# Altium project radxa_cm3_io_board_v1360_schematic.PrjPcb (part 3 of 5)

## Sheet 12.USB OTG_ HUB.SchDoc: CM3 IO
size 420 x 297 mm; Page Create Date: March  8, 1995; Page Number: 12; Page Size: A3; Comment: radxa_1010; Page Count: 20; RevCode: 1.36; Doc: USB OTG/ HUB; DsnPath: D:\WMS\黄工\[RC119]CM3_IO_V1.36\对外资料\radxa_cm3_io_board_v1360.DSN; SchematicName: CM3_IO V1.36; PageName: 12.USB OTG/ HUB; PageSize: A3; TopSchematic: True
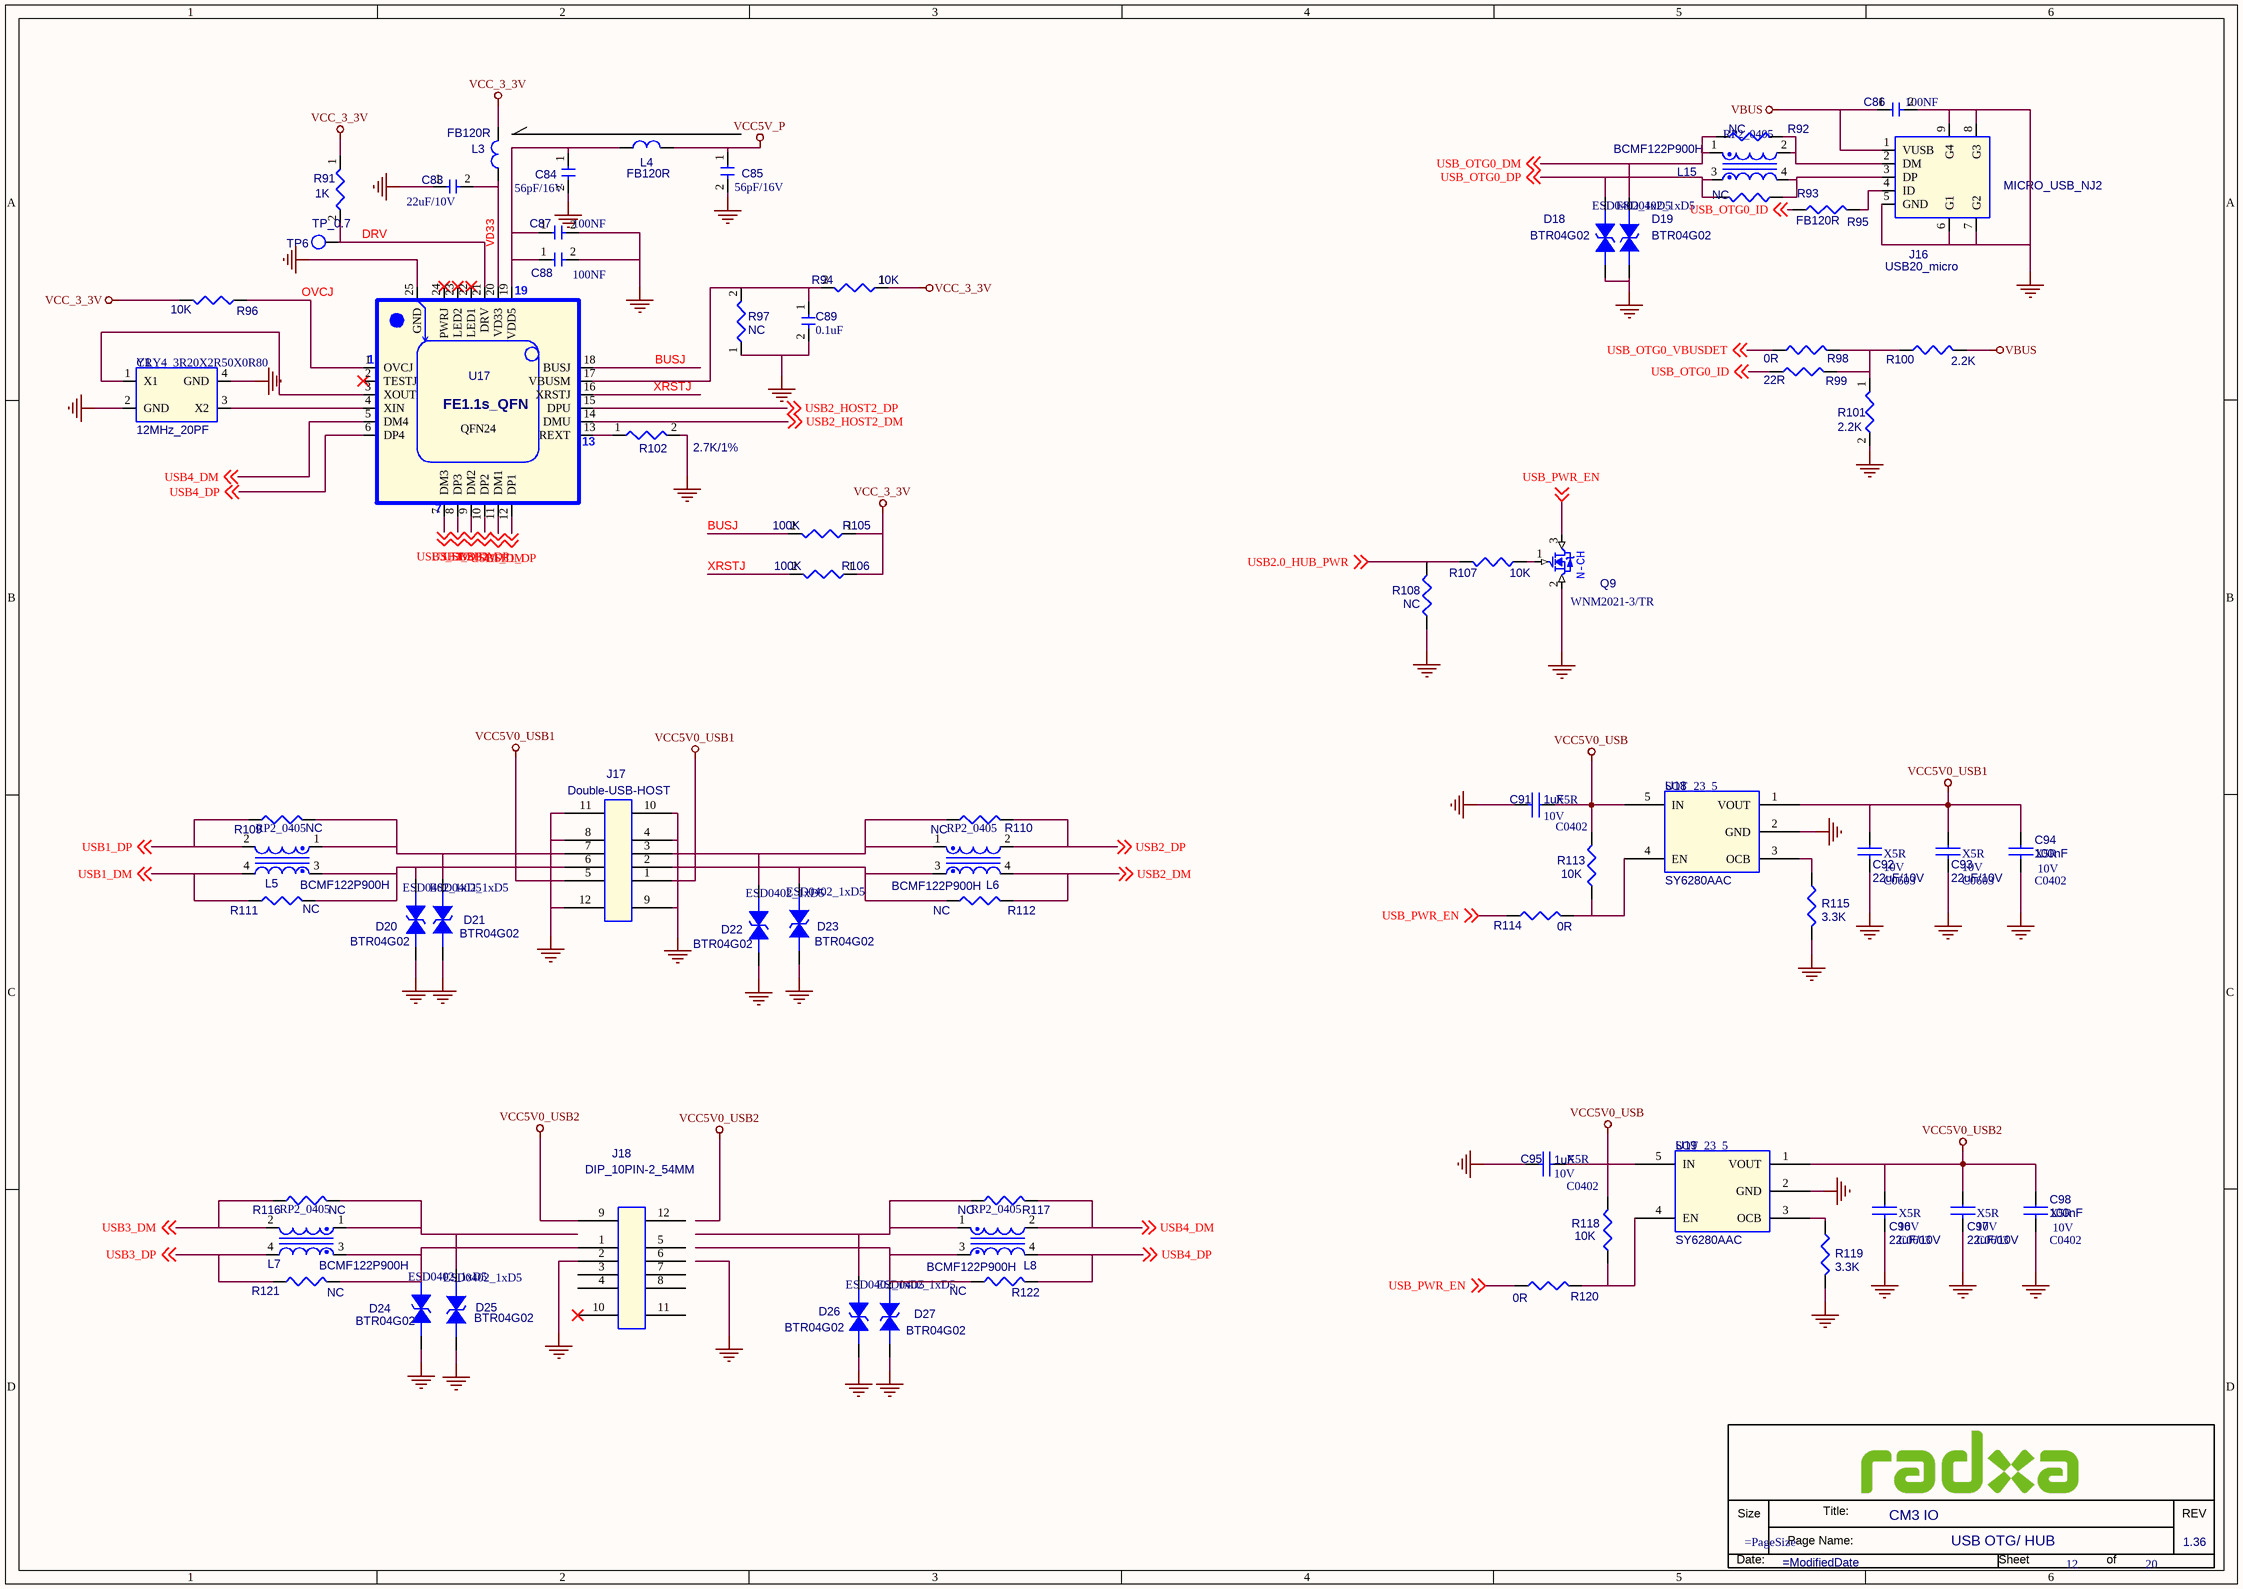
[diagram p10: 12.USB OTG_ HUB.SchDoc]

### Parts
(Parts that share a designator on the sheet are numbered #1, #2 ... from top to bottom, then left to right.)
*#11  Doc: USB OTG/ HUB  RevCode: 1.36  Title: CM3 IO  Page Number: 12  Page Count: 20  (hidden comment: radxa_1010)  (graphical)
C83  22uF/10V  [C0603]
C84  56pF/16V  [C0603]
C85  56pF/16V  [C0603]
C86  100NF  [C0603]
C87  100NF  [C0603]
C88  100NF  [C0603]
C89  0.1uF  [C0603]
C91  1uF  Voltage: 10V  Dielectric: X5R  [C0402]
C92  22uF/10V  Voltage: 10V  Dielectric: X5R  [C0603]
C93  22uF/10V  Voltage: 10V  Dielectric: X5R  [C0603]
C94  100nF  Voltage: 10V  Dielectric: X5R  [C0402]
C95  1uF  Voltage: 10V  Dielectric: X5R  [C0402]
C96  22uF/10V  Voltage: 10V  Dielectric: X5R  [C0603]
C97  22uF/10V  Voltage: 10V  Dielectric: X5R  [C0603]
C98  100nF  Voltage: 10V  Dielectric: X5R  [C0402]
D18  BTR04G02  [ESD0402_1xD5]
D19  BTR04G02  [ESD0402_1xD5]
D20  BTR04G02  [ESD0402_1xD5]
D21  BTR04G02  [ESD0402_1xD5]
D22  BTR04G02  [ESD0402_1xD5]
D23  BTR04G02  [ESD0402_1xD5]
D24  BTR04G02  [ESD0402_1xD5]
D25  BTR04G02  [ESD0402_1xD5]
D26  BTR04G02  [ESD0402_1xD5]
D27  BTR04G02  [ESD0402_1xD5]
J16  USB20_micro  PCB Footprint: MICRO_USB_NJ2  [USB-5PAA]
J17  Double-USB-HOST  [USB_DUAL]
J18  DIP_10PIN-2_54MM  [DIP_10PIN-2_54MM]
L3  FB120R  [R0402]
L4  FB120R  [L0402]
L5  BCMF122P900H  PCB Footprint: RP2_0405  [L0402D]
L6  BCMF122P900H  PCB Footprint: RP2_0405  [L0402D]
L7  BCMF122P900H  PCB Footprint: RP2_0405  [L0402D]
L8  BCMF122P900H  PCB Footprint: RP2_0405  [L0402D]
L15  BCMF122P900H  PCB Footprint: RP2_0405  [L0402D]
Q9  WNM2021-3/TR  [S0T-23]
R91  1K  [R0603]
R92  NC  [R0201]
R93  NC  [R0201]
R94  10K  [R0603]
R95  FB120R  [R0402]
R96  10K  [R0402]
R97  NC  [R0603]
R98  0R  [R0402]
R99  22R  [R0402]
R100  2.2K  [R0402]
R101  2.2K  [R0603]
R102  2.7K/1%  [R0603]
R105  100K  [R0603]
R106  100K  [R0603]
R107  10K  [R0402]
R108  NC  [R0402]
R109  NC  [R0201]
R110  NC  [R0201]
R111  NC  [R0201]
R112  NC  [R0201]
R113  10K  [R0402]
R114  0R  [R0402]
R115  3.3K  [R0402]
R116  NC  [R0201]
R117  NC  [R0201]
R118  10K  [R0402]
R119  3.3K  [R0402]
R120  0R  [R0402]
R121  NC  [R0201]
R122  NC  [R0201]
TP6  TP_0.7  [TEST]
U17  FE1.1s_QFN  [QFN24]
U18  SY6280AAC  [SOT_23_5]
U19  SY6280AAC  [SOT_23_5]
Y1  12MHz_20PF  PCB Footprint: CRY4_3R20X2R50X0R80  [CRY-3225]

### Nets
GND: C83.1 C84.2 C85.2 C86.2 C87.2 C88.2 C89.2 C91.2 C92.2 C93.2 C94.2 C95.2 C96.2 C97.2 C98.2 D18.1 D19.1 D20.1 D21.1 D22.1 D23.1 D24.1 D25.1 D26.1 D27.1 J16.5(GND) J16.6(G1) J16.7(G2) J16.8(G3) J16.9(G4) J17.4 J17.8 J17.9 J17.10 J17.11 J17.12 J18.2 Q9.2(S) R97.1 R101.2 R102.2 R108.2 R115.2 R119.2 U17.25(GND) U18.2(GND) U19.2(GND) Y1.2(GND) Y1.4(GND)
VBUS: C86.1 J16.1(VUSB) R100.2
VCC5V0_USB: C91.1 C95.1 R113.1 R118.1 U18.5(IN) U19.5(IN)
VCC5V0_USB1: C92.1 C93.1 C94.1 J17.1 J17.5 U18.1(VOUT)
VCC5V0_USB2: C96.1 C97.1 C98.1 J18.9 U19.1(VOUT)
VCC5V_P: C85.1 L4.1
VCC_3_3V: L3.2 R91.1 R94.1 R96.1 R105.1 R106.1
BUSJ: R105.2 U17.18(BUSJ)
DRV: R91.2 TP6.1 U17.21(DRV)
OVCJ: R96.2 U17.1(OVCJ)
USB1_DM: L5.4 R111.1 U17.11(DM1) ; off-sheet USB1_DM
USB1_DP: L5.2 R109.1 U17.12(DP1) ; off-sheet USB1_DP
USB2.0_HUB_PWR: R107.2 R108.1 ; off-sheet USB2.0_HUB_PWR
USB2_DM: L6.4 R112.1 U17.9(DM2) ; off-sheet USB2_DM
USB2_DP: L6.2 R110.1 U17.10(DP2) ; off-sheet USB2_DP
USB2_HOST2_DM: U17.14(DMU) ; off-sheet USB2_HOST2_DM
USB2_HOST2_DP: U17.15(DPU) ; off-sheet USB2_HOST2_DP
USB3_DM: L7.2 R116.1 U17.7(DM3) ; off-sheet USB3_DM
USB3_DP: L7.4 R121.1 U17.8(DP3) ; off-sheet USB3_DP
USB4_DM: L8.2 R117.1 U17.5(DM4) ; off-sheet USB4_DM
USB4_DP: L8.4 R122.1 U17.6(DP4) ; off-sheet USB4_DP
USB_OTG0_DM: D19.2 L15.1 R92.2 ; off-sheet USB_OTG0_DM
USB_OTG0_DP: D18.2 L15.3 R93.2 ; off-sheet USB_OTG0_DP
USB_OTG0_ID: R95.2 R99.2 ; off-sheet USB_OTG0_ID
USB_OTG0_VBUSDET: R98.2 ; off-sheet USB_OTG0_VBUSDET
USB_PWR_EN: Q9.3(D) R114.2 R120.2 ; off-sheet USB_PWR_EN
VD33: C83.2 L3.1 U17.20(VD33)
XRSTJ: R106.2 U17.16(XRSTJ)
NetC84_1: C84.1 C87.1 C88.1 L4.2 U17.19(VDD5)
NetC89_1: C89.1 R94.2 R97.2 U17.17(VBUSM)
NetD20_2: D20.2 J17.6 L5.3 R111.2
NetD21_2: D21.2 J17.7 L5.1 R109.2
NetD22_2: D22.2 J17.3 L6.1 R110.2
NetD23_2: D23.2 J17.2 L6.3 R112.2
NetD24_2: D24.2 J18.1 L7.3 R121.2
NetD25_2: D25.2 L7.1 R116.2
NetD26_2: D26.2 L8.1 R117.2
NetD27_2: D27.2 L8.3 R122.2
NetJ16_2: J16.2(DM) L15.2 R92.1
NetJ16_3: J16.3(DP) L15.4 R93.1
NetJ16_4: J16.4(ID) R95.1
NetQ9_1: Q9.1(G) R107.1
NetR98_1: R98.1 R99.1 R100.1 R101.1
NetR102_1: R102.1 U17.13(REXT)
NetR113_2: R113.2 R114.1 U18.4(EN)
NetR115_1: R115.1 U18.3(OCB)
NetR118_2: R118.2 R120.1 U19.4(EN)
NetR119_1: R119.1 U19.3(OCB)
NetU17_3: U17.3(XOUT) Y1.1(X1)
NetU17_4: U17.4(XIN) Y1.3(X2)

Not connected (* = marked no-connect by the designer): J18 3 4 5 6 7 8 10* 11 12; U17 2(TESTJ)* 22(LED1)* 23(LED2)* 24(PWRJ)*

### Notes on the sheet
- (in symbol N-MOSFET) N-CH
- (in symbol radxa_1010) Title:; Size; REV; Page Name:; Date:; Sheet; of

### Library data of the parts
C83 = CAP_0.1uF_0603: Part Reference: C83; Value: 22uF/10V; PCB Footprint: C0603
C84 = CAP_0.1uF_0603: Part Reference: C84; PCB Footprint: C0402; Value: 56pF/16V
C85 = CAP_0.1uF_0603: Part Reference: C85; PCB Footprint: C0402; Value: 56pF/16V
C86 = CAP_0.1uF_0603: Part Reference: C86; PCB Footprint: C0402; Value: 100NF
C87 = CAP_0.1uF_0603: Part Reference: C87; PCB Footprint: C0402; Value: 100NF
C88 = CAP_0.1uF_0603: Part Reference: C88; PCB Footprint: C0402; Value: 100NF
C89 = CAP_0.1uF_0603: Part Reference: C89; PCB Footprint: C0402; Value: 0.1uF
C91 = CAP NP_0: cap,1.00uF,+/-10%,10V,X5R,C0402; Part Reference: C91; Manufacturer: TDK; RK PN: C1005X5R1A105K050BB; Priority: A; C_Voltage: 6.3V; Tolerance: 10%; PCB Footprint: C0402; Value: 1uF; Part Type: C0402; Manufacturer PN: C1005X5R1A105K050BB; Created by: JJJ
C92 = CAP NP_0: cap,100.00nF,+/-10%,10V,X5R,C0402; Part Reference: C92; Manufacturer PN: C1005X5R1A104K050BA; Manufacturer: TDK; Tolerance: 10%; Priority: A; PCB Footprint: C0603; Value: 22uF/10V; Created by: JJJ; Part Type: C0402; RK PN: C1005X5R1A104K050BA
C93 = CAP NP_0: cap,100.00nF,+/-10%,10V,X5R,C0402; Part Reference: C93; Manufacturer PN: C1005X5R1A104K050BA; Manufacturer: TDK; Tolerance: 10%; Priority: A; PCB Footprint: C0603; Value: 22uF/10V; Created by: JJJ; Part Type: C0402; RK PN: C1005X5R1A104K050BA
C94 = CAP NP_0: cap,100.00nF,+/-10%,10V,X5R,C0402; Part Reference: C94; Manufacturer: TDK; RK PN: C1005X5R1A104K050BA; Priority: A; Tolerance: 10%; PCB Footprint: C0402; Value: 100nF; Part Type: C0402; Manufacturer PN: C1005X5R1A104K050BA; Created by: JJJ
C95 = CAP NP_0: cap,1.00uF,+/-10%,10V,X5R,C0402; Part Reference: C95; Manufacturer PN: C1005X5R1A105K050BB; Manufacturer: TDK; Tolerance: 10%; C_Voltage: 6.3V; Priority: A; PCB Footprint: C0402; Value: 1uF; Created by: JJJ; Part Type: C0402; RK PN: C1005X5R1A105K050BB
C96 = CAP NP_0: cap,100.00nF,+/-10%,10V,X5R,C0402; Part Reference: C96; Manufacturer: TDK; RK PN: C1005X5R1A104K050BA; Priority: A; Tolerance: 10%; PCB Footprint: C0603; Value: 22uF/10V; Part Type: C0402; Manufacturer PN: C1005X5R1A104K050BA; Created by: JJJ
C97 = CAP NP_0: cap,100.00nF,+/-10%,10V,X5R,C0402; Part Reference: C97; Manufacturer PN: C1005X5R1A104K050BA; Manufacturer: TDK; Tolerance: 10%; Priority: A; PCB Footprint: C0603; Value: 22uF/10V; Created by: JJJ; Part Type: C0402; RK PN: C1005X5R1A104K050BA
C98 = CAP NP_0: cap,100.00nF,+/-10%,10V,X5R,C0402; Part Reference: C98; Manufacturer: TDK; RK PN: C1005X5R1A104K050BA; Priority: A; Tolerance: 10%; PCB Footprint: C0402; Value: 100nF; Part Type: C0402; Manufacturer PN: C1005X5R1A104K050BA; Created by: JJJ
D18 = DIODE BI_DIR TRIG_0: 1-Line, Bi-directional, Transient Voltage Suppressors.17.5pF.; Part Reference: D18; Manufacturer: WillSemi(韦尔半导体); RK PN: ESD5451N; Priority: A; OPTION: DNP; PCB Footprint: ESD0402_1xD5; Value: BTR04G02; Part Type: ESD_TVS; Manufacturer PN: ESD5451N; Created by: JJJ
D19 = DIODE BI_DIR TRIG_0: 1-Line, Bi-directional, Transient Voltage Suppressors.17.5pF.; Part Reference: D19; Manufacturer PN: ESD5451N; Manufacturer: WillSemi(韦尔半导体); OPTION: DNP; Priority: A; PCB Footprint: ESD0402_1xD5; Value: BTR04G02; Created by: JJJ; Part Type: ESD_TVS; RK PN: ESD5451N
D20 = DIODE BI_DIR TRIG_0: 1-Line, Bi-directional, Transient Voltage Suppressors.17.5pF.; Part Reference: D20; Manufacturer PN: ESD5451N; Manufacturer: WillSemi(韦尔半导体); OPTION: DNP; Priority: A; PCB Footprint: ESD0402_1xD5; Value: BTR04G02; Created by: JJJ; Part Type: ESD_TVS; RK PN: ESD5451N
D21 = DIODE BI_DIR TRIG_0: 1-Line, Bi-directional, Transient Voltage Suppressors.17.5pF.; Part Reference: D21; Manufacturer PN: ESD5451N; Manufacturer: WillSemi(韦尔半导体); OPTION: DNP; Priority: A; PCB Footprint: ESD0402_1xD5; Value: BTR04G02; Created by: JJJ; Part Type: ESD_TVS; RK PN: ESD5451N
D22 = DIODE BI_DIR TRIG_0: 1-Line, Bi-directional, Transient Voltage Suppressors.17.5pF.; Part Reference: D22; Manufacturer PN: ESD5451N; Manufacturer: WillSemi(韦尔半导体); OPTION: DNP; Priority: A; PCB Footprint: ESD0402_1xD5; Value: BTR04G02; Created by: JJJ; Part Type: ESD_TVS; RK PN: ESD5451N
D23 = DIODE BI_DIR TRIG_0: 1-Line, Bi-directional, Transient Voltage Suppressors.17.5pF.; Part Reference: D23; Manufacturer PN: ESD5451N; Manufacturer: WillSemi(韦尔半导体); OPTION: DNP; Priority: A; PCB Footprint: ESD0402_1xD5; Value: BTR04G02; Created by: JJJ; Part Type: ESD_TVS; RK PN: ESD5451N
D24 = DIODE BI_DIR TRIG_0: 1-Line, Bi-directional, Transient Voltage Suppressors.17.5pF.; Part Reference: D24; Manufacturer PN: ESD5451N; Manufacturer: WillSemi(韦尔半导体); OPTION: DNP; Priority: A; PCB Footprint: ESD0402_1xD5; Value: BTR04G02; Created by: JJJ; Part Type: ESD_TVS; RK PN: ESD5451N
D25 = DIODE BI_DIR TRIG_0: 1-Line, Bi-directional, Transient Voltage Suppressors.17.5pF.; Part Reference: D25; Manufacturer PN: ESD5451N; Manufacturer: WillSemi(韦尔半导体); OPTION: DNP; Priority: A; PCB Footprint: ESD0402_1xD5; Value: BTR04G02; Created by: JJJ; Part Type: ESD_TVS; RK PN: ESD5451N
D26 = DIODE BI_DIR TRIG_0: 1-Line, Bi-directional, Transient Voltage Suppressors.17.5pF.; Part Reference: D26; Manufacturer: WillSemi(韦尔半导体); RK PN: ESD5451N; Priority: A; OPTION: DNP; PCB Footprint: ESD0402_1xD5; Value: BTR04G02; Part Type: ESD_TVS; Manufacturer PN: ESD5451N; Created by: JJJ
D27 = DIODE BI_DIR TRIG_0: 1-Line, Bi-directional, Transient Voltage Suppressors.17.5pF.; Part Reference: D27; Manufacturer PN: ESD5451N; Manufacturer: WillSemi(韦尔半导体); OPTION: DNP; Priority: A; PCB Footprint: ESD0402_1xD5; Value: BTR04G02; Created by: JJJ; Part Type: ESD_TVS; RK PN: ESD5451N
J16 = USB20_MICRO: micro型USB2.0座，卧式，贴焊; Part Reference: J16; Manufacturer: 祺华电子; Priority: A; Value: USB20_micro; Created by: JJJ; Manufacturer Part Number: USB20_micro; Part Type: USB Jack; RK PN: USB20_micro
J17 = CON4_0: Part Reference: J17; Value: Double-USB-HOST; PCB Footprint: USB_DUAL
J18 = CON4_0: Part Reference: J18; Value: DIP_10PIN-2_54MM; PCB Footprint: DIP_10PIN-2_54MM
L3 = CHOKE RF: Part Reference: L3; Value: FB120R; PCB Footprint: R0402
L4 = CHOKE RF: Part Reference: L4; Value: FB120R; PCB Footprint: L0402
L5 = INDUCTOR COM: Winding Type Common Mode Choke Coil; Part Reference: L5; Manufacturer PN: SDCW2012-2-900TF; Manufacturer: sunlord; Resonace frequency: 90R@100M; Irms: 330mA; Tolerance: 25%; DC Resistor: 0.35ohm; Priority: A; Value: BCMF122P900H; Created by: JJJ; Part Type: IND; RK PN: SDCW2012-2-900TF
L6 = INDUCTOR COM: Winding Type Common Mode Choke Coil; Part Reference: L6; Manufacturer PN: SDCW2012-2-900TF; Manufacturer: sunlord; Resonace frequency: 90R@100M; Irms: 330mA; Tolerance: 25%; DC Resistor: 0.35ohm; Priority: A; Value: BCMF122P900H; Created by: JJJ; Part Type: IND; RK PN: SDCW2012-2-900TF
L7 = INDUCTOR COM: Winding Type Common Mode Choke Coil; Part Reference: L7; Manufacturer PN: SDCW2012-2-900TF; Manufacturer: sunlord; Resonace frequency: 90R@100M; Irms: 330mA; Tolerance: 25%; DC Resistor: 0.35ohm; Priority: A; Value: BCMF122P900H; Created by: JJJ; Part Type: IND; RK PN: SDCW2012-2-900TF
L8 = INDUCTOR COM: Winding Type Common Mode Choke Coil; Part Reference: L8; Manufacturer: sunlord; RK PN: SDCW2012-2-900TF; Priority: A; DC Resistor: 0.35ohm; Tolerance: 25%; Irms: 330mA; Resonace frequency: 90R@100M; Value: BCMF122P900H; Part Type: IND; Manufacturer PN: SDCW2012-2-900TF; Created by: JJJ
L15 = INDUCTOR COM: Winding Type Common Mode Choke Coil; Part Reference: L15; Manufacturer PN: SDCW2012-2-900TF; Manufacturer: sunlord; Resonace frequency: 90R@100M; Irms: 330mA; Tolerance: 25%; DC Resistor: 0.35ohm; Priority: A; Value: BCMF122P900H; Created by: JJJ; Part Type: IND; RK PN: SDCW2012-2-900TF
Q9 = N-MOSFET: Part Reference: Q9; SANZ_P/N: SK2300; Value: WNM2021-3/TR; Part Type: MOS管; PCB Footprint: S0T-23
R91 = RES_0603: Part Reference: R91; PCB Footprint: R0402; Value: 1K
R92 = RESISTOR_0: 通用厚膜电阻,0R,+/-5%,R0402,1/16W.; Part Reference: R92; Manufacturer: YAGEO; RK PN: RC0402JR-070RL; Priority: A; Tolerance: 5%; Wattage: 1/16W; Value: NC; Part Type: 通用厚膜电阻; Manufacturer PN: RC0402JR-070RL; Created by: YTL; PCB Footprint: R0201
R93 = RESISTOR_0: 通用厚膜电阻,0R,+/-5%,R0402,1/16W.; Part Reference: R93; Manufacturer PN: RC0402JR-070RL; Manufacturer: YAGEO; Wattage: 1/16W; Tolerance: 5%; Priority: A; Value: NC; Created by: YTL; Part Type: 通用厚膜电阻; RK PN: RC0402JR-070RL; PCB Footprint: R0201
R94 = RES_0603: Part Reference: R94; PCB Footprint: R0402; Value: 10K
R95 = RESISTOR_0: 通用厚膜电阻,0R,+/-5%,R0402,1/16W.; Part Reference: R95; Manufacturer: YAGEO; RK PN: RC0402JR-070RL; Priority: A; Tolerance: 5%; Wattage: 1/16W; Value: FB120R; Part Type: 通用厚膜电阻; Manufacturer PN: RC0402JR-070RL; Created by: YTL; PCB Footprint: R0402
R96 = RESISTOR_0: 通用厚膜电阻,0R,+/-5%,R0402,1/16W.; Part Reference: R96; Manufacturer: YAGEO; RK PN: RC0402JR-070RL; Priority: A; Tolerance: 5%; Wattage: 1/16W; option: DNP; Value: 10K; Part Type: 通用厚膜电阻; Manufacturer PN: RC0402JR-070RL; Created by: YTL; PCB Footprint: R0402
R97 = RES_0603: Part Reference: R97; PCB Footprint: R0402; Value: NC
R98 = RESISTOR_0: 通用厚膜电阻,0R,+/-5%,R0402,1/16W.; Part Reference: R98; Manufacturer: YAGEO; RK PN: RC0402JR-070RL; Priority: A; Tolerance: 5%; Wattage: 1/16W; Value: 0R; Part Type: 通用厚膜电阻; Manufacturer PN: RC0402JR-070RL; Created by: YTL; PCB Footprint: R0402
R99 = RESISTOR_0: 通用厚膜电阻,0R,+/-5%,R0402,1/16W.; Part Reference: R99; Manufacturer PN: RC0402JR-070RL; Manufacturer: YAGEO; Wattage: 1/16W; Tolerance: 5%; Priority: A; Value: 22R; Created by: YTL; Part Type: 通用厚膜电阻; RK PN: RC0402JR-070RL; PCB Footprint: R0402
R100 = RESISTOR_0: 通用厚膜电阻,0R,+/-5%,R0402,1/16W.; Part Reference: R100; Manufacturer: YAGEO; RK PN: RC0402JR-070RL; Priority: A; Tolerance: 5%; Wattage: 1/16W; Value: 2.2K; Part Type: 通用厚膜电阻; Manufacturer PN: RC0402JR-070RL; Created by: YTL; PCB Footprint: R0402
R101 = RES_0603: Part Reference: R101; PCB Footprint: R0402; Value: 2.2K
R102 = RES_0603: Part Reference: R102; PCB Footprint: R0402; Value: 2.7K/1%
R105 = RES_0603: Part Reference: R105; PCB Footprint: R0402; Value: 100K
R106 = RES_0603: Part Reference: R106; PCB Footprint: R0402; Value: 100K
R107 = RESISTOR_1: RES,thick film,47KOhm,+/-5%,1/16W,SMD0402; Part Reference: R107; Value: 10K; PCB Footprint: R0402
R108 = RESISTOR_0: RES,thick film,47KOhm,+/-5%,1/16W,SMD0402; Part Reference: R108; MARK: 51K; Value: NC; PCB Footprint: R0402
R109 = RESISTOR_0: 通用厚膜电阻,0R,+/-5%,R0402,1/16W.; Part Reference: R109; Manufacturer: YAGEO; RK PN: RC0402JR-070RL; Priority: A; Tolerance: 5%; Wattage: 1/16W; Value: NC; Part Type: 通用厚膜电阻; Manufacturer PN: RC0402JR-070RL; Created by: YTL; PCB Footprint: R0201
R110 = RESISTOR_0: 通用厚膜电阻,0R,+/-5%,R0402,1/16W.; Part Reference: R110; Manufacturer PN: RC0402JR-070RL; Manufacturer: YAGEO; Wattage: 1/16W; Tolerance: 5%; Priority: A; Value: NC; Created by: YTL; Part Type: 通用厚膜电阻; RK PN: RC0402JR-070RL; PCB Footprint: R0201
R111 = RESISTOR_0: 通用厚膜电阻,0R,+/-5%,R0402,1/16W.; Part Reference: R111; Manufacturer: YAGEO; RK PN: RC0402JR-070RL; Priority: A; Tolerance: 5%; Wattage: 1/16W; Value: NC; Part Type: 通用厚膜电阻; Manufacturer PN: RC0402JR-070RL; Created by: YTL; PCB Footprint: R0201
R112 = RESISTOR_0: 通用厚膜电阻,0R,+/-5%,R0402,1/16W.; Part Reference: R112; Manufacturer PN: RC0402JR-070RL; Manufacturer: YAGEO; Wattage: 1/16W; Tolerance: 5%; Priority: A; Value: NC; Created by: YTL; Part Type: 通用厚膜电阻; RK PN: RC0402JR-070RL; PCB Footprint: R0201
R113 = RESISTOR_0: 通用厚膜电阻,4K7,+/-5%,R0402,1/16W.; Part Reference: R113; Manufacturer PN: RC0402JR-074K7L; Manufacturer: YAGEO; Wattage: 1/16W; Tolerance: 5%; Priority: A; Value: 10K; Created by: YTL; Part Type: 通用厚膜电阻; RK PN: RC0402JR-074K7L; PCB Footprint: R0402
R114 = RESISTOR_0: 通用厚膜电阻,0R,+/-5%,R0402,1/16W.; Part Reference: R114; Manufacturer PN: RC0402JR-070RL; Manufacturer: YAGEO; Wattage: 1/16W; Tolerance: 5%; Priority: A; Value: 0R; Created by: YTL; Part Type: 通用厚膜电阻; RK PN: RC0402JR-070RL; PCB Footprint: R0402
R115 = RESISTOR_0: 通用厚膜电阻,4K7,+/-5%,R0402,1/16W.; Part Reference: R115; Manufacturer PN: RC0402JR-074K7L; Manufacturer: YAGEO; Wattage: 1/16W; Tolerance: 5%; Priority: A; Value: 3.3K; Created by: YTL; Part Type: 通用厚膜电阻; RK PN: RC0402JR-074K7L; PCB Footprint: R0402
R116 = RESISTOR_0: 通用厚膜电阻,0R,+/-5%,R0402,1/16W.; Part Reference: R116; Manufacturer: YAGEO; RK PN: RC0402JR-070RL; Priority: A; Tolerance: 5%; Wattage: 1/16W; Value: NC; Part Type: 通用厚膜电阻; Manufacturer PN: RC0402JR-070RL; Created by: YTL; PCB Footprint: R0201
R117 = RESISTOR_0: 通用厚膜电阻,0R,+/-5%,R0402,1/16W.; Part Reference: R117; Manufacturer PN: RC0402JR-070RL; Manufacturer: YAGEO; Wattage: 1/16W; Tolerance: 5%; Priority: A; Value: NC; Created by: YTL; Part Type: 通用厚膜电阻; RK PN: RC0402JR-070RL; PCB Footprint: R0201
R118 = RESISTOR_0: 通用厚膜电阻,4K7,+/-5%,R0402,1/16W.; Part Reference: R118; Manufacturer: YAGEO; RK PN: RC0402JR-074K7L; Priority: A; Tolerance: 5%; Wattage: 1/16W; Value: 10K; Part Type: 通用厚膜电阻; Manufacturer PN: RC0402JR-074K7L; Created by: YTL; PCB Footprint: R0402
R119 = RESISTOR_0: 通用厚膜电阻,4K7,+/-5%,R0402,1/16W.; Part Reference: R119; Manufacturer PN: RC0402JR-074K7L; Manufacturer: YAGEO; Wattage: 1/16W; Tolerance: 5%; Priority: A; Value: 3.3K; Created by: YTL; Part Type: 通用厚膜电阻; RK PN: RC0402JR-074K7L; PCB Footprint: R0402
R120 = RESISTOR_0: 通用厚膜电阻,0R,+/-5%,R0402,1/16W.; Part Reference: R120; Manufacturer: YAGEO; RK PN: RC0402JR-070RL; Priority: A; Tolerance: 5%; Wattage: 1/16W; Value: 0R; Part Type: 通用厚膜电阻; Manufacturer PN: RC0402JR-070RL; Created by: YTL; PCB Footprint: R0402
R121 = RESISTOR_0: 通用厚膜电阻,0R,+/-5%,R0402,1/16W.; Part Reference: R121; Manufacturer: YAGEO; RK PN: RC0402JR-070RL; Priority: A; Tolerance: 5%; Wattage: 1/16W; Value: NC; Part Type: 通用厚膜电阻; Manufacturer PN: RC0402JR-070RL; Created by: YTL; PCB Footprint: R0201
R122 = RESISTOR_0: 通用厚膜电阻,0R,+/-5%,R0402,1/16W.; Part Reference: R122; Manufacturer PN: RC0402JR-070RL; Manufacturer: YAGEO; Wattage: 1/16W; Tolerance: 5%; Priority: A; Value: NC; Created by: YTL; Part Type: 通用厚膜电阻; RK PN: RC0402JR-070RL; PCB Footprint: R0201
TP6 = TP: Test Point 0.7mm; Part Reference: TP6; PCB Footprint: TP_0R70; RK PN: TESTPOINT_0R7; Priority: A; Value: TP_0.7; Part Type: TP; Created by: JJJ
U17 = FE1_1s_B_QFN24_2: Part Reference: U17; Value: FE1.1s_QFN; PCB Footprint: QFN24
U18 = SWITCH_SY6280: Low Loss Power Distribution Switch; Part Reference: U18; Manufacturer: Silergy（矽力杰）; Priority: A; PCB Footprint: SOT_23_5; Value: SY6280AAC; RK PN: SY6280AAC; Part Type: Switch; Manufacturer PN: SY6280AAC; Created by: JJJ
U19 = SWITCH_SY6280: Low Loss Power Distribution Switch; Part Reference: U19; Manufacturer: Silergy（矽力杰）; Priority: A; PCB Footprint: SOT_23_5; Value: SY6280AAC; RK PN: SY6280AAC; Part Type: Switch; Manufacturer PN: SY6280AAC; Created by: JJJ
Y1 = CRYSTAL_4P: 无源晶振，25M，3225,±10ppm，10pF，Hosonic; Part Reference: Y1; Manufacturer PN: E3SB25.0000F10E11; Manufacturer: Hosonic(鸿星电子); Priority: A; Value: 12MHz_20PF; Created by: JJJ; Part Type: CRYSTAL; RK PN: E3SB25.0000F10E11
*#11 = radxa_1010: Page Create Date: March  8, 1995; Page Size: =PageSize; Page Modify Date: =ModifiedDate

## Sheet 13.USB HOST.SchDoc: CM3 IO
size 386 x 246 mm; Page Create Date: March  8, 1995; Page Number: 13; Page Size: B; Comment: radxa_1010; Page Count: 20; RevCode: 1.36; Doc: USB HOST; DsnPath: D:\WMS\黄工\[RC119]CM3_IO_V1.36\对外资料\radxa_cm3_io_board_v1360.DSN; SchematicName: CM3_IO V1.36; PageName: 13.USB HOST; PageSize: B; TopSchematic: True
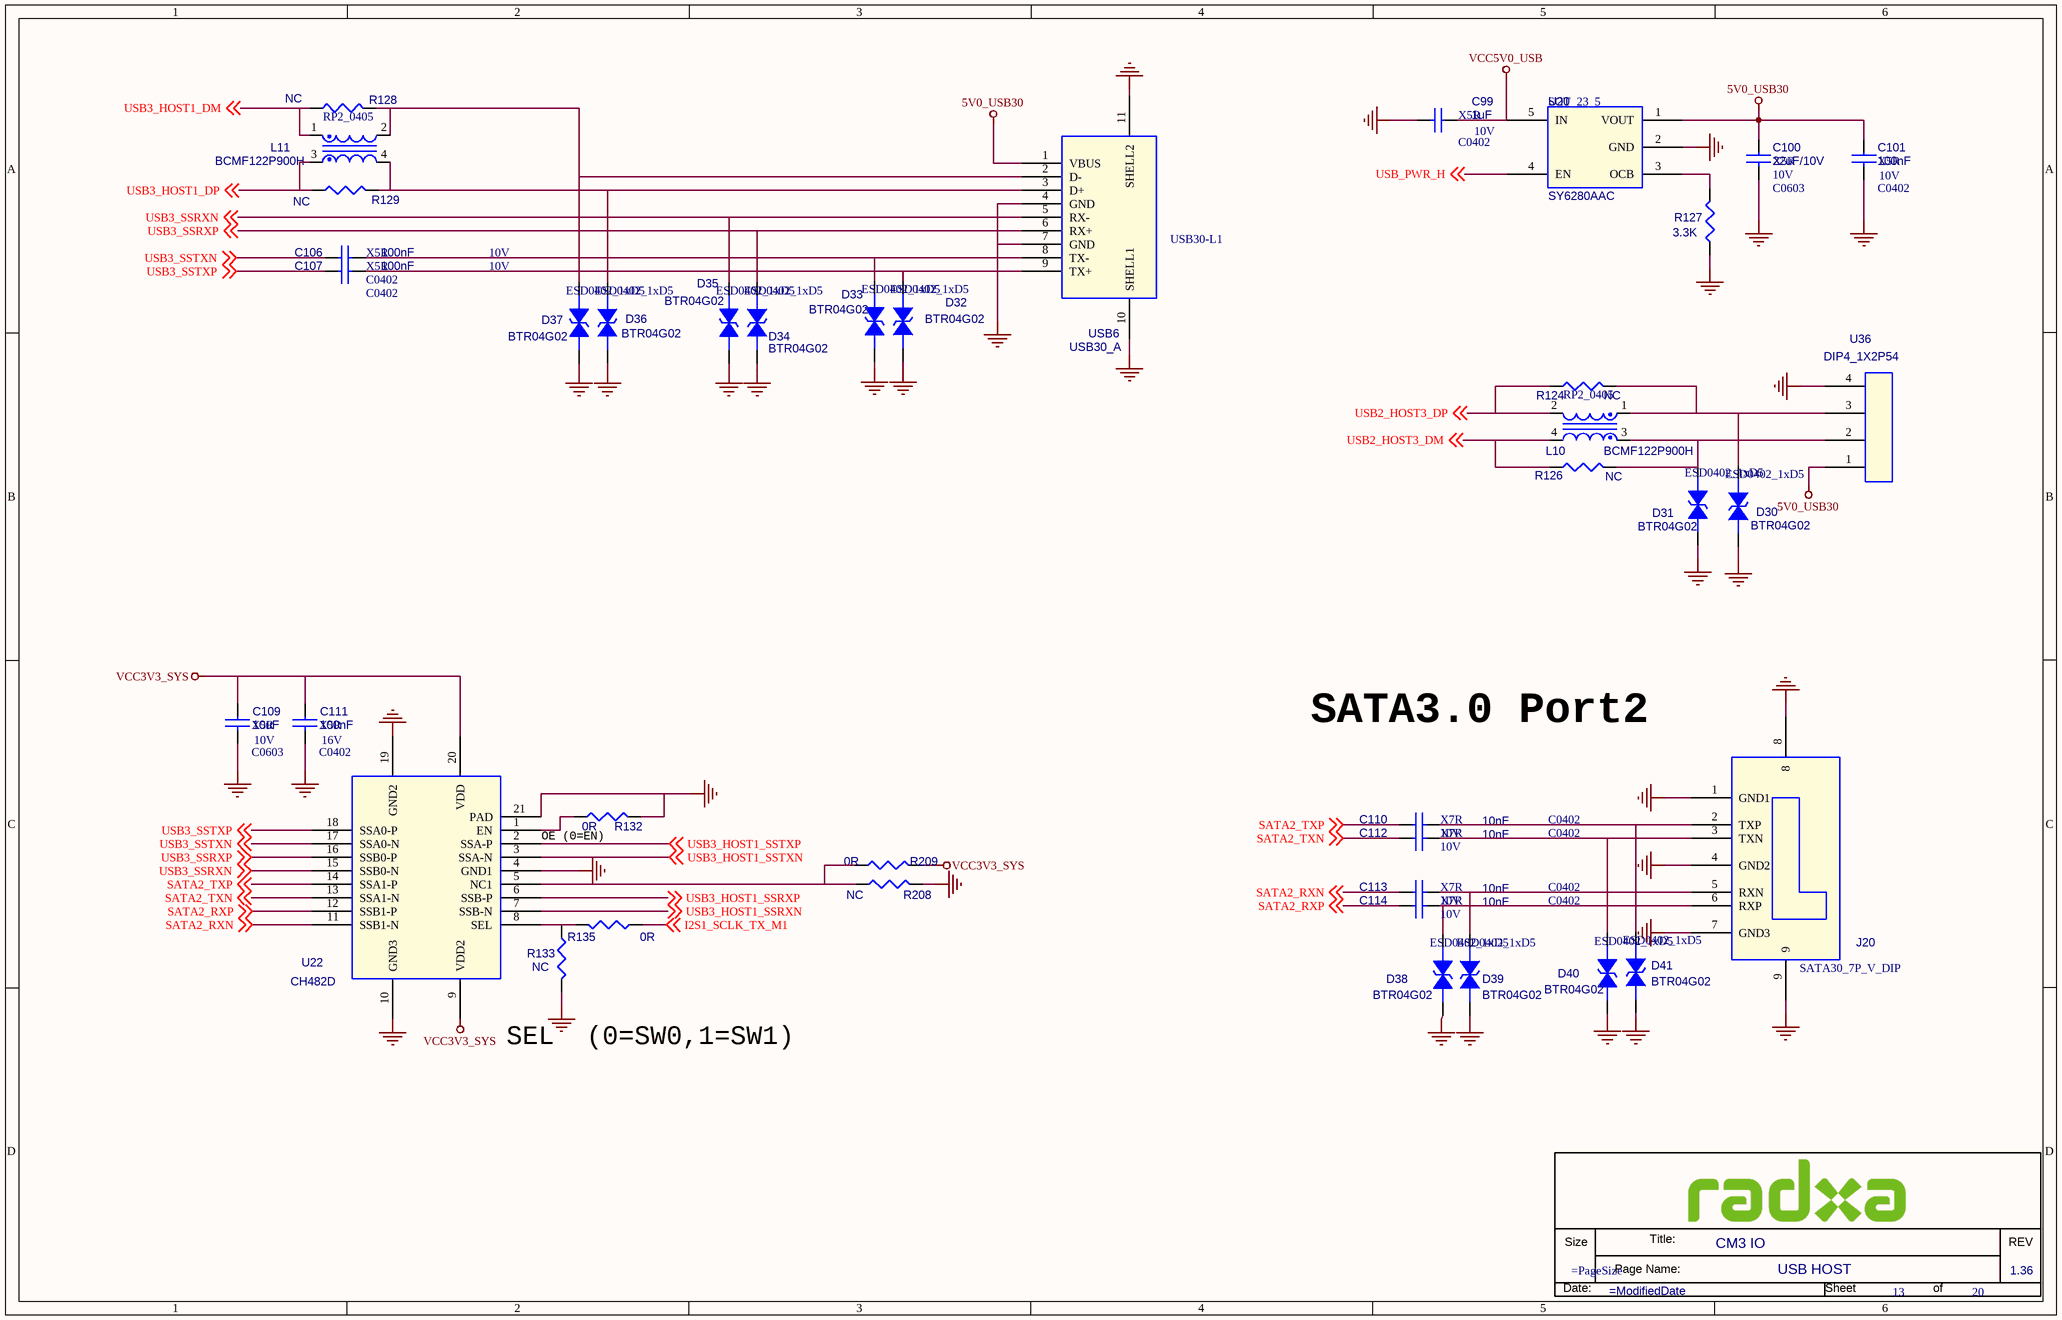
[diagram p11: 13.USB HOST.SchDoc]

### Parts
(Parts that share a designator on the sheet are numbered #1, #2 ... from top to bottom, then left to right.)
*#12  Doc: USB HOST  RevCode: 1.36  Title: CM3 IO  Page Number: 13  Page Count: 20  (hidden comment: radxa_1010)  (graphical)
C99  1uF  Voltage: 10V  Dielectric: X5R  [C0402]
C100  22uF/10V  Voltage: 10V  Dielectric: X5R  [C0603]
C101  100nF  Voltage: 10V  Dielectric: X5R  [C0402]
C106  100nF  Voltage: 10V  Dielectric: X5R  [C0402]
C107  100nF  Voltage: 10V  Dielectric: X5R  [C0402]
C109  10uF  Voltage: 10V  Dielectric: X5R  [C0603]
C110  10nF  Voltage: 10V  Dielectric: X7R  [C0402]
C111  100nF  Voltage: 16V  Dielectric: X5R  [C0402]
C112  10nF  Voltage: 10V  Dielectric: X7R  [C0402]
C113  10nF  Voltage: 10V  Dielectric: X7R  [C0402]
C114  10nF  Voltage: 10V  Dielectric: X7R  [C0402]
D30  BTR04G02  [ESD0402_1xD5]
D31  BTR04G02  [ESD0402_1xD5]
D32  BTR04G02  [ESD0402_1xD5]
D33  BTR04G02  [ESD0402_1xD5]
D34  BTR04G02  [ESD0402_1xD5]
D35  BTR04G02  [ESD0402_1xD5]
D36  BTR04G02  [ESD0402_1xD5]
D37  BTR04G02  [ESD0402_1xD5]
D38  BTR04G02  [ESD0402_1xD5]
D39  BTR04G02  [ESD0402_1xD5]
D40  BTR04G02  [ESD0402_1xD5]
D41  BTR04G02  [ESD0402_1xD5]
J20  SATA30_7P_V_DIP  [SMD_SATA_7P_50_180]
L10  BCMF122P900H  PCB Footprint: RP2_0405  [L0402D]
L11  BCMF122P900H  PCB Footprint: RP2_0405  [L0402D]
R124  NC  [R0201]
R126  NC  [R0201]
R127  3.3K  [R0402]
R128  NC  [R0201]
R129  NC  [R0201]
R132  0R  [R0402]
R133  NC  [R0402]
R135  0R  [R0402]
R208  NC  [R0402]
R209  0R  [R0402]
U20  SY6280AAC  [SOT_23_5]
U22  CH482D  [CH482X]
U36  DIP4_1X2P54  [DIP4_1X2P54]
USB6  USB30_A  PCB Footprint: USB30-L1  [USB30]

### Nets
5V0_USB30: C100.1 C101.1 U20.1(VOUT) U36.1 USB6.1(VBUS)
GND: C99.2 C100.2 C101.2 C109.2 C111.2 D30.1 D31.1 D32.1 D33.1 D34.1 D35.1 D36.1 D37.1 D38.1 D39.1 D40.1 D41.1 J20.1(GND1) J20.4(GND2) J20.7(GND3) J20.8 J20.9 R127.2 R132.1 R133.2 R208.1 U20.2(GND) U22.4(GND1) U22.10(GND3) U22.19(GND2) U22.21(PAD) U36.4 USB6.4(GND) USB6.7(GND) USB6.10(SHELL1) USB6.11(SHELL2)
VCC3V3_SYS: C109.1 C111.1 R209.1 U22.9(VDD2) U22.20(VDD)
VCC5V0_USB: C99.1 U20.5(IN)
I2S1_SCLK_TX_M1: R135.2 ; off-sheet I2S1_SCLK_TX_M1
SATA2_RXN: C113.1 U22.11(SSB1-N) ; off-sheet SATA2_RXN
SATA2_RXP: C114.1 U22.12(SSB1-P) ; off-sheet SATA2_RXP
SATA2_TXN: C112.1 U22.13(SSA1-N) ; off-sheet SATA2_TXN
SATA2_TXP: C110.1 U22.14(SSA1-P) ; off-sheet SATA2_TXP
USB2_HOST3_DM: L10.4 R126.1 ; off-sheet USB2_HOST3_DM
USB2_HOST3_DP: L10.2 R124.1 ; off-sheet USB2_HOST3_DP
USB3_HOST1_DM: L11.1 R128.2 ; off-sheet USB3_HOST1_DM
USB3_HOST1_DP: L11.3 R129.2 ; off-sheet USB3_HOST1_DP
USB3_HOST1_SSRXN: U22.7(SSB-N) ; off-sheet USB3_HOST1_SSRXN
USB3_HOST1_SSRXP: U22.6(SSB-P) ; off-sheet USB3_HOST1_SSRXP
USB3_HOST1_SSTXN: U22.3(SSA-N) ; off-sheet USB3_HOST1_SSTXN
USB3_HOST1_SSTXP: U22.2(SSA-P) ; off-sheet USB3_HOST1_SSTXP
USB3_SSRXN: D35.2 U22.15(SSB0-N) USB6.5(RX-) ; off-sheet USB3_SSRXN
USB3_SSRXP: D34.2 U22.16(SSB0-P) USB6.6(RX+) ; off-sheet USB3_SSRXP
USB3_SSTXN: C106.1 U22.17(SSA0-N) ; off-sheet USB3_SSTXN
USB3_SSTXP: C107.1 U22.18(SSA0-P) ; off-sheet USB3_SSTXP
USB_PWR_H: U20.4(EN) ; off-sheet USB_PWR_H
NetC106_2: C106.2 D33.2 USB6.8(TX-)
NetC107_2: C107.2 D32.2 USB6.9(TX+)
NetC110_2: C110.2 D41.2 J20.2(TXP)
NetC112_2: C112.2 D40.2 J20.3(TXN)
NetC113_2: C113.2 D39.2 J20.5(RXN)
NetC114_2: C114.2 D38.2 J20.6(RXP)
NetD30_2: D30.2 L10.1 R124.2 U36.3
NetD31_2: D31.2 L10.3 R126.2 U36.2
NetD36_2: D36.2 L11.4 R129.1 USB6.3(D+)
NetD37_2: D37.2 L11.2 R128.1 USB6.2(D-)
NetR127_1: R127.1 U20.3(OCB)
NetR132_2: R132.2 U22.1(EN)
NetR133_1: R133.1 R135.1 U22.8(SEL)
NetR208_2: R208.2 R209.2 U22.5(NC1)

### Notes on the sheet
- SATA3.0 Port2
- (near R132) OE (0=EN)
- SEL  (0=SW0,1=SW1)
- (in symbol radxa_1010) Size; Title:; REV; Page Name:; Date:; Sheet; of

### Library data of the parts
C99 = CAP NP_0: cap,1.00uF,+/-10%,10V,X5R,C0402; Part Reference: C99; Manufacturer PN: C1005X5R1A105K050BB; Manufacturer: TDK; Tolerance: 10%; C_Voltage: 6.3V; Priority: A; PCB Footprint: C0402; Value: 1uF; Created by: JJJ; Part Type: C0402; RK PN: C1005X5R1A105K050BB
C100 = CAP NP_0: cap,100.00nF,+/-10%,10V,X5R,C0402; Part Reference: C100; Manufacturer: TDK; RK PN: C1005X5R1A104K050BA; Priority: A; Tolerance: 10%; PCB Footprint: C0603; Value: 22uF/10V; Part Type: C0402; Manufacturer PN: C1005X5R1A104K050BA; Created by: JJJ
C101 = CAP NP_0: cap,100.00nF,+/-10%,10V,X5R,C0402; Part Reference: C101; Manufacturer PN: C1005X5R1A104K050BA; Manufacturer: TDK; Tolerance: 10%; Priority: A; PCB Footprint: C0402; Value: 100nF; Created by: JJJ; Part Type: C0402; RK PN: C1005X5R1A104K050BA
C106 = CAP NP_0: cap,100.00nF,+/-10%,10V,X5R,C0201; Part Reference: C106; Manufacturer: TDK; RK PN: C0603X5R1A104K030BC; Priority: A; Tolerance: 10%; PCB Footprint: C0402; Value: 100nF; Part Type: C0201; Manufacturer PN: C0603X5R1A104K030BC; Created by: JJJ
C107 = CAP NP_0: cap,100.00nF,+/-10%,10V,X5R,C0201; Part Reference: C107; Manufacturer PN: C0603X5R1A104K030BC; Manufacturer: TDK; Tolerance: 10%; Priority: A; PCB Footprint: C0402; Value: 100nF; Created by: JJJ; Part Type: C0201; RK PN: C0603X5R1A104K030BC
C109 = CAP NP_0: cap,22.00uF,+/-10%,10V,X5R,C0805; Part Reference: C109; Manufacturer PN: C2012X5R1A226K125AB; Manufacturer: TDK; Tolerance: 10%; Priority: A; PCB Footprint: C0603; Value: 10uF; Created by: JJJ; Part Type: C0805; RK PN: C2012X5R1A226K125AB
C110 = CAP NP_0: cap,10.00nF,+/-10%,10V,X7R,C0201; Part Reference: C110; Manufacturer: TDK; RK PN: C0603X7R1A103K030BA; Priority: A; Tolerance: 10%; PCB Footprint: C0402; Value: 10nF; Part Type: C0201; Manufacturer PN: C0603X7R1A103K030BA; Created by: JJJ
C111 = CAP NP_0: cap,100.00nF,+/-10%,16V,X5R,C0402; Part Reference: C111; Manufacturer PN: C1005X5R1C104K050BA; Manufacturer: TDK; Tolerance: 10%; Priority: A; PCB Footprint: C0402; Value: 100nF; Created by: JJJ; Part Type: C0402; RK PN: C1005X5R1C104K050BA
C112 = CAP NP_0: cap,10.00nF,+/-10%,10V,X7R,C0201; Part Reference: C112; Manufacturer: TDK; RK PN: C0603X7R1A103K030BA; Priority: A; Tolerance: 10%; PCB Footprint: C0402; Value: 10nF; Part Type: C0201; Manufacturer PN: C0603X7R1A103K030BA; Created by: JJJ
C113 = CAP NP_0: cap,10.00nF,+/-10%,10V,X7R,C0201; Part Reference: C113; Manufacturer: TDK; RK PN: C0603X7R1A103K030BA; Priority: A; Tolerance: 10%; PCB Footprint: C0402; Value: 10nF; Part Type: C0201; Manufacturer PN: C0603X7R1A103K030BA; Created by: JJJ
C114 = CAP NP_0: cap,10.00nF,+/-10%,10V,X7R,C0201; Part Reference: C114; Manufacturer: TDK; RK PN: C0603X7R1A103K030BA; Priority: A; Tolerance: 10%; PCB Footprint: C0402; Value: 10nF; Part Type: C0201; Manufacturer PN: C0603X7R1A103K030BA; Created by: JJJ
D30 = DIODE BI_DIR TRIG_0: 1-Line, Bi-directional, Transient Voltage Suppressors.17.5pF.; Part Reference: D30; Manufacturer: WillSemi(韦尔半导体); RK PN: ESD5451N; Priority: A; OPTION: DNP; PCB Footprint: ESD0402_1xD5; Value: BTR04G02; Part Type: ESD_TVS; Manufacturer PN: ESD5451N; Created by: JJJ
D31 = DIODE BI_DIR TRIG_0: 1-Line, Bi-directional, Transient Voltage Suppressors.17.5pF.; Part Reference: D31; Manufacturer PN: ESD5451N; Manufacturer: WillSemi(韦尔半导体); OPTION: DNP; Priority: A; PCB Footprint: ESD0402_1xD5; Value: BTR04G02; Created by: JJJ; Part Type: ESD_TVS; RK PN: ESD5451N
D32 = DIODE BI_DIR TRIG_0: 1-Line, Bi-directional, Transient Voltage Suppressors.17.5pF.; Part Reference: D32; Manufacturer PN: ESD5451N; Manufacturer: WillSemi(韦尔半导体); OPTION: DNP; Priority: A; PCB Footprint: ESD0402_1xD5; Value: BTR04G02; Created by: JJJ; Part Type: ESD_TVS; RK PN: ESD5451N
D33 = DIODE BI_DIR TRIG_0: 1-Line, Bi-directional, Transient Voltage Suppressors.17.5pF.; Part Reference: D33; Manufacturer: WillSemi(韦尔半导体); RK PN: ESD5451N; Priority: A; OPTION: DNP; PCB Footprint: ESD0402_1xD5; Value: BTR04G02; Part Type: ESD_TVS; Manufacturer PN: ESD5451N; Created by: JJJ
D34 = DIODE BI_DIR TRIG_0: 1-Line, Bi-directional, Transient Voltage Suppressors.17.5pF.; Part Reference: D34; Manufacturer: WillSemi(韦尔半导体); RK PN: ESD5451N; Priority: A; OPTION: DNP; PCB Footprint: ESD0402_1xD5; Value: BTR04G02; Part Type: ESD_TVS; Manufacturer PN: ESD5451N; Created by: JJJ
D35 = DIODE BI_DIR TRIG_0: 1-Line, Bi-directional, Transient Voltage Suppressors.17.5pF.; Part Reference: D35; Manufacturer PN: ESD5451N; Manufacturer: WillSemi(韦尔半导体); OPTION: DNP; Priority: A; PCB Footprint: ESD0402_1xD5; Value: BTR04G02; Created by: JJJ; Part Type: ESD_TVS; RK PN: ESD5451N
D36 = DIODE BI_DIR TRIG_0: 1-Line, Bi-directional, Transient Voltage Suppressors.17.5pF.; Part Reference: D36; Manufacturer PN: ESD5451N; Manufacturer: WillSemi(韦尔半导体); OPTION: DNP; Priority: A; PCB Footprint: ESD0402_1xD5; Value: BTR04G02; Created by: JJJ; Part Type: ESD_TVS; RK PN: ESD5451N
D37 = DIODE BI_DIR TRIG_0: 1-Line, Bi-directional, Transient Voltage Suppressors.17.5pF.; Part Reference: D37; Manufacturer PN: ESD5451N; Manufacturer: WillSemi(韦尔半导体); OPTION: DNP; Priority: A; PCB Footprint: ESD0402_1xD5; Value: BTR04G02; Created by: JJJ; Part Type: ESD_TVS; RK PN: ESD5451N
D38 = DIODE BI_DIR TRIG_0: 1-Line, Bi-directional, Transient Voltage Suppressors.17.5pF.; Part Reference: D38; Manufacturer: WillSemi(韦尔半导体); RK PN: ESD5451N; Priority: A; OPTION: DNP; PCB Footprint: ESD0402_1xD5; Value: BTR04G02; Part Type: ESD_TVS; Manufacturer PN: ESD5451N; Created by: JJJ
D39 = DIODE BI_DIR TRIG_0: 1-Line, Bi-directional, Transient Voltage Suppressors.17.5pF.; Part Reference: D39; Manufacturer PN: ESD5451N; Manufacturer: WillSemi(韦尔半导体); OPTION: DNP; Priority: A; PCB Footprint: ESD0402_1xD5; Value: BTR04G02; Created by: JJJ; Part Type: ESD_TVS; RK PN: ESD5451N
D40 = DIODE BI_DIR TRIG_0: 1-Line, Bi-directional, Transient Voltage Suppressors.17.5pF.; Part Reference: D40; Manufacturer: WillSemi(韦尔半导体); RK PN: ESD5451N; Priority: A; OPTION: DNP; PCB Footprint: ESD0402_1xD5; Value: BTR04G02; Part Type: ESD_TVS; Manufacturer PN: ESD5451N; Created by: JJJ
D41 = DIODE BI_DIR TRIG_0: 1-Line, Bi-directional, Transient Voltage Suppressors.17.5pF.; Part Reference: D41; Manufacturer: WillSemi(韦尔半导体); RK PN: ESD5451N; Priority: A; OPTION: DNP; PCB Footprint: ESD0402_1xD5; Value: BTR04G02; Part Type: ESD_TVS; Manufacturer PN: ESD5451N; Created by: JJJ
J20 = SATA_DIP_1: Part Reference: J20; Value: SATA30_7P_V_DIP; PCB Footprint: SMD_SATA_7P_50_180
L10 = INDUCTOR COM: Winding Type Common Mode Choke Coil; Part Reference: L10; Manufacturer: sunlord; RK PN: SDCW2012-2-900TF; Priority: A; DC Resistor: 0.35ohm; Tolerance: 25%; Irms: 330mA; Resonace frequency: 90R@100M; Value: BCMF122P900H; Part Type: IND; Manufacturer PN: SDCW2012-2-900TF; Created by: JJJ
L11 = INDUCTOR COM: Winding Type Common Mode Choke Coil; Part Reference: L11; Manufacturer PN: SDCW2012-2-900TF; Manufacturer: sunlord; Resonace frequency: 90R@100M; Irms: 330mA; Tolerance: 25%; DC Resistor: 0.35ohm; Priority: A; Value: BCMF122P900H; Created by: JJJ; Part Type: IND; RK PN: SDCW2012-2-900TF
R124 = RESISTOR_0: 通用厚膜电阻,0R,+/-5%,R0402,1/16W.; Part Reference: R124; Manufacturer PN: RC0402JR-070RL; Manufacturer: YAGEO; Wattage: 1/16W; Tolerance: 5%; Priority: A; Value: NC; Created by: YTL; Part Type: 通用厚膜电阻; RK PN: RC0402JR-070RL; PCB Footprint: R0201
R126 = RESISTOR_0: 通用厚膜电阻,0R,+/-5%,R0402,1/16W.; Part Reference: R126; Manufacturer: YAGEO; RK PN: RC0402JR-070RL; Priority: A; Tolerance: 5%; Wattage: 1/16W; Value: NC; Part Type: 通用厚膜电阻; Manufacturer PN: RC0402JR-070RL; Created by: YTL; PCB Footprint: R0201
R127 = RESISTOR_0: 通用厚膜电阻,4K7,+/-5%,R0402,1/16W.; Part Reference: R127; Manufacturer: YAGEO; RK PN: RC0402JR-074K7L; Priority: A; Tolerance: 5%; Wattage: 1/16W; Value: 3.3K; Part Type: 通用厚膜电阻; Manufacturer PN: RC0402JR-074K7L; Created by: YTL; PCB Footprint: R0402
R128 = RESISTOR_0: 通用厚膜电阻,4K7,+/-1%,R0402,1/16W.; Part Reference: R128; Manufacturer: YAGEO; RK PN: RC0402FR-074K7L; Priority: A; Tolerance: 1%; Wattage: 1/16W; Value: NC; Part Type: 通用厚膜电阻; Manufacturer PN: RC0402FR-074K7L; Created by: YTL; PCB Footprint: R0201
R129 = RESISTOR_0: 通用厚膜电阻,4K7,+/-1%,R0402,1/16W.; Part Reference: R129; Manufacturer: YAGEO; RK PN: RC0402FR-074K7L; Priority: A; Tolerance: 1%; Wattage: 1/16W; Value: NC; Part Type: 通用厚膜电阻; Manufacturer PN: RC0402FR-074K7L; Created by: YTL; PCB Footprint: R0201
R132 = RESISTOR_0: 通用厚膜电阻,0R,+/-5%,R0402,1/16W.; Part Reference: R132; Manufacturer: YAGEO; RK PN: RC0402JR-070RL; Priority: A; Tolerance: 5%; Wattage: 1/16W; Value: 0R; Part Type: 通用厚膜电阻; Manufacturer PN: RC0402JR-070RL; Created by: YTL; PCB Footprint: R0402
R133 = RESISTOR_0: 通用厚膜电阻,4K7,+/-5%,R0402,1/16W.; Part Reference: R133; Manufacturer PN: RC0402JR-074K7L; Manufacturer: YAGEO; Wattage: 1/16W; Tolerance: 5%; Priority: A; Value: NC; Created by: YTL; Part Type: 通用厚膜电阻; RK PN: RC0402JR-074K7L; PCB Footprint: R0402
R135 = RESISTOR_0: 通用厚膜电阻,100R,+/-5%,R0402,1/16W.; Part Reference: R135; Manufacturer PN: RC0402JR-07100RL; Manufacturer: YAGEO; Wattage: 1/16W; Tolerance: 5%; Priority: A; Value: 0R; Created by: YTL; Part Type: 通用厚膜电阻; RK PN: RC0402JR-07100RL; PCB Footprint: R0402
R208 = RESISTOR_0: 通用厚膜电阻,0R,+/-5%,R0402,1/16W.; Part Reference: R208; Manufacturer: YAGEO; RK PN: RC0402JR-070RL; Priority: A; Tolerance: 5%; Wattage: 1/16W; Value: NC; Part Type: 通用厚膜电阻; Manufacturer PN: RC0402JR-070RL; Created by: YTL; PCB Footprint: R0402
R209 = RESISTOR_0: 通用厚膜电阻,0R,+/-5%,R0402,1/16W.; Part Reference: R209; Manufacturer PN: RC0402JR-070RL; Manufacturer: YAGEO; Wattage: 1/16W; Tolerance: 5%; Priority: A; Value: 0R; Created by: YTL; Part Type: 通用厚膜电阻; RK PN: RC0402JR-070RL; PCB Footprint: R0402
U20 = SWITCH_SY6280: Low Loss Power Distribution Switch; Part Reference: U20; Manufacturer: Silergy（矽力杰）; Priority: A; PCB Footprint: SOT_23_5; Value: SY6280AAC; Created by: JJJ; Manufacturer PN: SY6280AAC; Part Type: Switch; RK PN: SY6280AAC
U22 = CH482X: Part Reference: U22; PCB Footprint: QFN20-2D5X4D5; Value: CH482D
U36 = CON3_5: Part Reference: U36; Value: DIP4_1X2P54; PCB Footprint: DIP4_1X2P54
USB6 = USB30_TYPE_A: A型USB3.0座，卧式，插焊; Part Reference: USB6; Manufacturer: 旺科达; Priority: A; RK PN: USB-HOST_30; Value: USB30_A; Created by: JJJ; Manufacturer Part Number: USB30_A; Part Type: USB Jack
*#12 = radxa_1010: Page Create Date: March  8, 1995; Page Size: =PageSize; Page Modify Date: =ModifiedDate

## Sheet 14.FAN_RTC_BAT.SchDoc: CM3 IO
size 297 x 209 mm; Page Create Date: March  8, 1995; Page Number: 14; Page Size: A4; Comment: radxa_1010; Page Count: 20; RevCode: 1.36; Doc: FAN_RTC_BAT; DsnPath: D:\WMS\黄工\[RC119]CM3_IO_V1.36\对外资料\radxa_cm3_io_board_v1360.DSN; SchematicName: CM3_IO V1.36; PageName: 14.FAN_RTC_BAT; PageSize: A4; TopSchematic: True
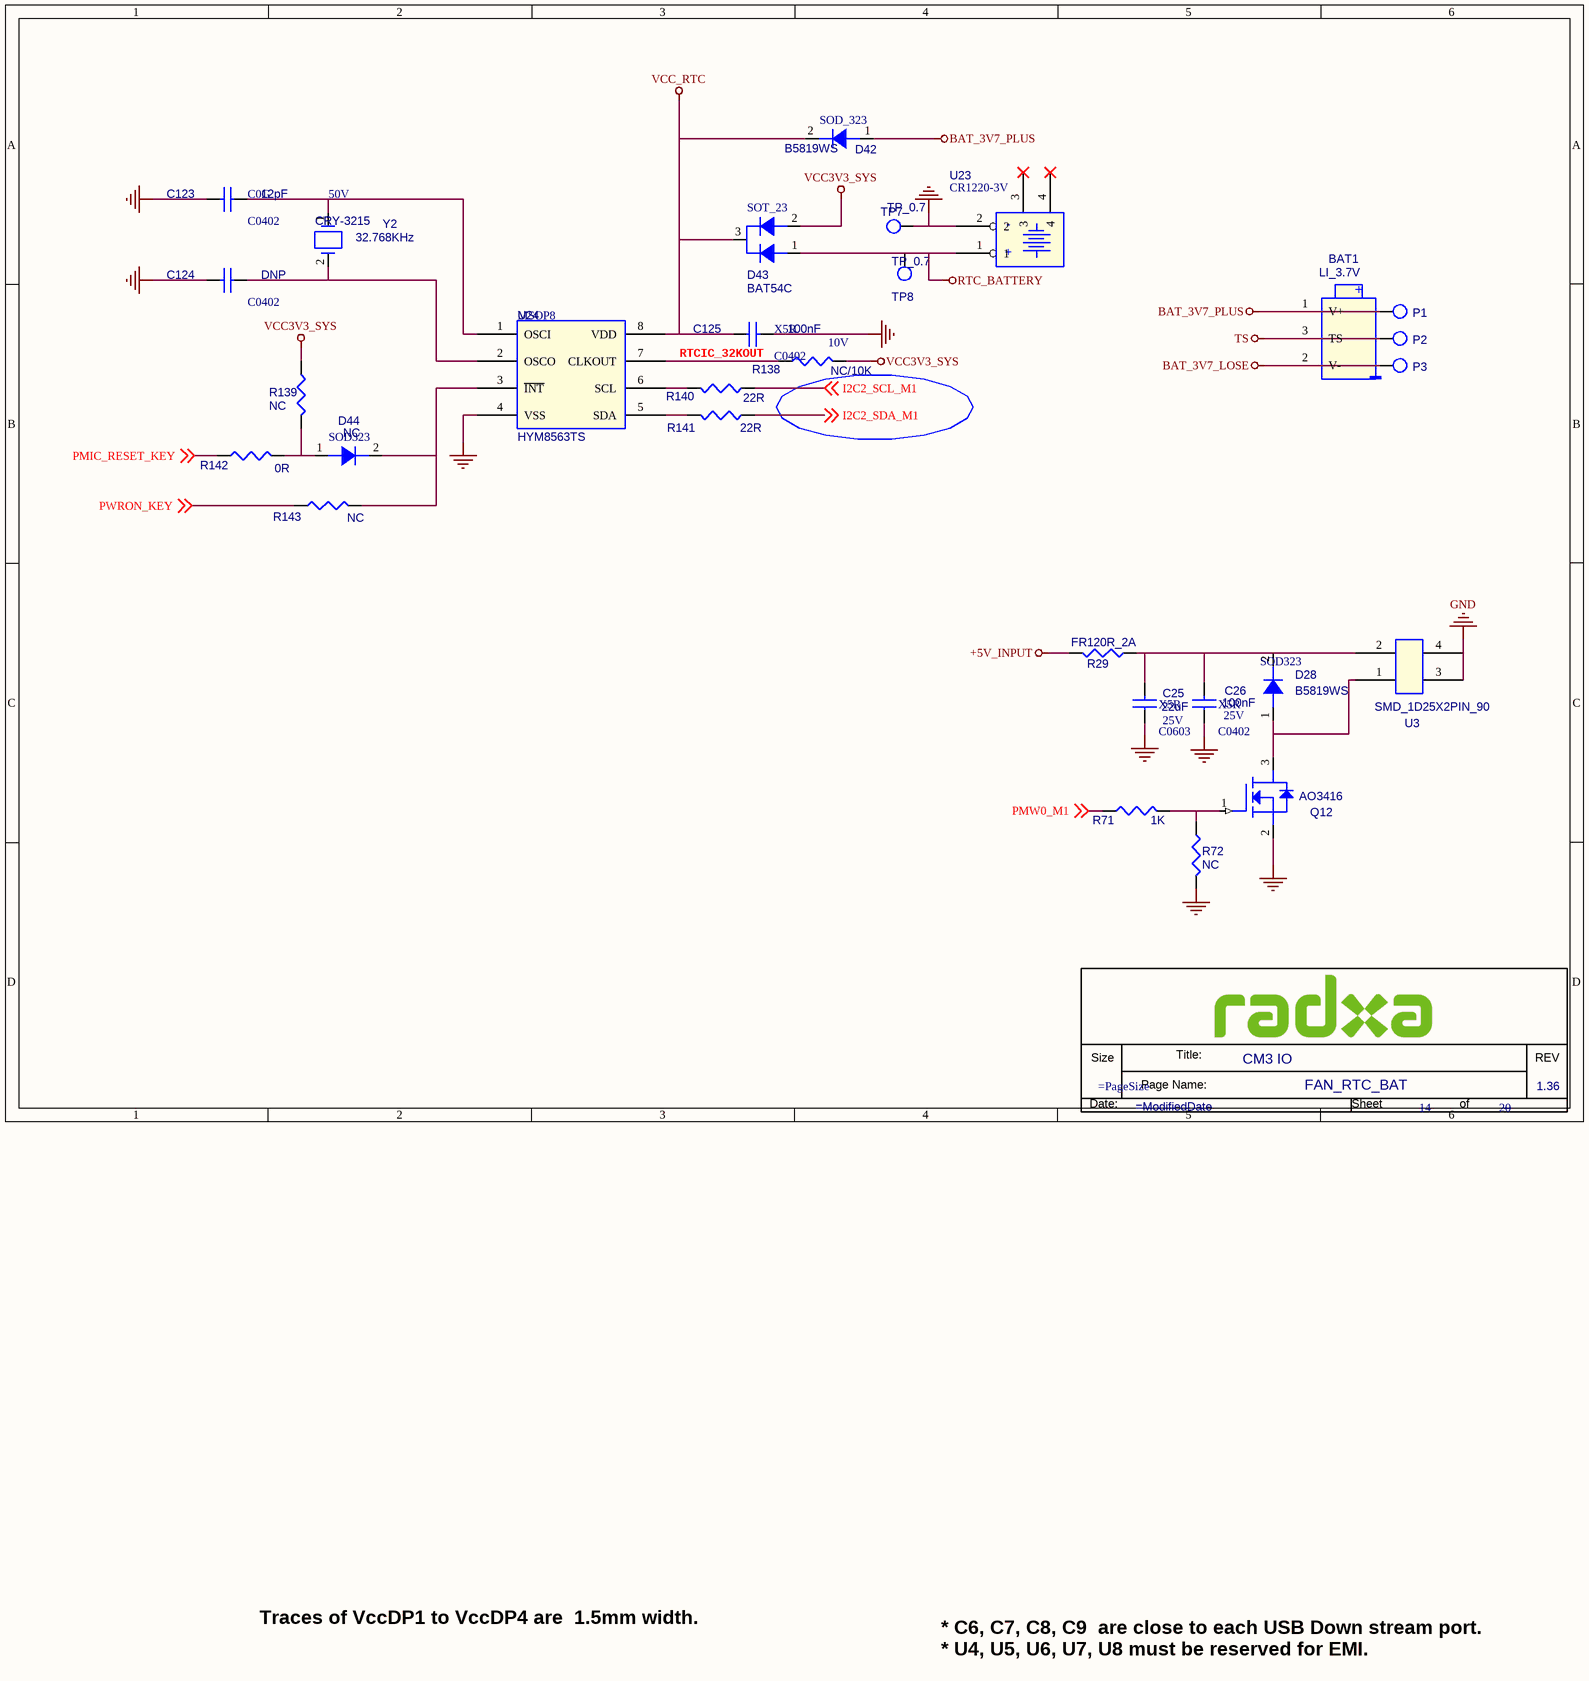
[diagram p12: 14.FAN_RTC_BAT.SchDoc]

### Parts
(Parts that share a designator on the sheet are numbered #1, #2 ... from top to bottom, then left to right.)
*#13  Doc: FAN_RTC_BAT  RevCode: 1.36  Title: CM3 IO  Page Number: 14  Page Count: 20  (hidden comment: radxa_1010)  (graphical)
BAT1  LI_3.7V  [SMD-3P-1.25]
C25  22uF  Voltage: 25V  Dielectric: X5R  [C0603]
C26  100nF  Voltage: 25V  Dielectric: X5R  [C0402]
C123  12pF  Voltage: 50V  Dielectric: C0G  [C0402]
C124  DNP  [C0402]
C125  100nF  Voltage: 10V  Dielectric: X5R  [C0402]
D28  B5819WS  [SOD323]
D42  B5819WS  [SOD_323]
D43  BAT54C  [SOT_23]
D44  NC  [SOD323]
P1  TEST  [TEST]  (value not drawn)
P2  TEST  [TEST]  (value not drawn)
P3  TEST  [TEST]  (value not drawn)
Q12  AO3416  [SOT23]
R29  FR120R_2A  [R0402]
R71  1K  [R0201]
R72  NC  [R0402]
R138  NC/10K  [R0402]
R139  NC  [R0402]
R140  22R  [R0402]
R141  22R  [R0402]
R142  0R  [R0402]
R143  NC  [R0402]
TP7  TP_0.7  [TEST]
TP8  TP_0.7  [TEST]
U3  SMD_1D25X2PIN_90  [SMD_1D25X2PIN_90]
U23  CR1220-3V  [BATTERY-20MM]
U24  HYM8563TS  [MSOP8]
Y2  32.768KHz  [CRY-3215]

### Nets
+5V_INPUT: R29.1
BAT_3V7_LOSE: BAT1.2(V-) P3.1
BAT_3V7_PLUS: BAT1.1(V+) D42.1(A) P1.1
GND: C25.1 C26.1 C123.2 C124.2 C125.2 Q12.2(SOURCE) R72.2 TP7.1 U3.3 U3.4 U23.2 U24.4(VSS)
RTC_BATTERY: D43.1(A1) TP8.1 U23.1
TS: BAT1.3(TS) P2.1
VCC3V3_SYS: D43.2(A2) R138.2 R139.1
VCC_RTC: C125.1 D42.2(K) D43.3(K) U24.8(VDD)
I2C2_SCL_M1: R140.1 ; off-sheet I2C2_SCL_M1
I2C2_SDA_M1: R141.1 ; off-sheet I2C2_SDA_M1
PMIC_RESET_KEY: R142.1 ; off-sheet PMIC_RESET_KEY
PMW0_M1: R71.1 ; off-sheet PMW0_M1
PWRON_KEY: R143.1 ; off-sheet PWRON_KEY
RTCIC_32KOUT: R138.1 U24.7(CLKOUT)
NetC25_2: C25.2 C26.2 D28.2(K) R29.2 U3.2
NetC123_1: C123.1 U24.1(OSCI) Y2.1
NetC124_1: C124.1 U24.2(OSCO) Y2.2
NetD28_1: D28.1(A) Q12.3(DRAIN) U3.1
NetD44_1: D44.1(A) R139.2 R142.2
NetD44_2: D44.2(K) R143.2 U24.3(~{INT})
NetQ12_1: Q12.1(GATE) R71.2 R72.1
NetR140_2: R140.2 U24.6(SCL)
NetR141_2: R141.2 U24.5(SDA)

Not connected (* = marked no-connect by the designer): U23 3* 4*

### Notes on the sheet
- * C6, C7, C8, C9  are close to each USB Down stream port.
  * U4, U5, U6, U7, U8 must be reserved for EMI.
- Traces of VccDP1 to VccDP4 are  1.5mm width.
- (in symbol BATTERY_1) +; -
- (in symbol CON_BATTERY-20MM_0) -; +
- (in symbol radxa_1010) Title:; Size; REV; Page Name:; Date:; Sheet; of

### Library data of the parts
BAT1 = BATTERY_1: Part Reference: BAT1; Value: LI_3.7V; PCB Footprint: SMD-3P-1.25
C25 = CAP NP_0: cap,22.00uF,+/-10%,10V,X5R,C0805; Part Reference: C25; Manufacturer PN: C2012X5R1A226K125AB; Manufacturer: TDK; Tolerance: 10%; Priority: A; PCB Footprint: C0603; Value: 22uF; Created by: JJJ; Part Type: C0805; RK PN: C2012X5R1A226K125AB
C26 = CAP NP_0: cap,100.00nF,+/-10%,16V,X5R,C0402; Part Reference: C26; Manufacturer: TDK; RK PN: C1005X5R1C104K050BA; Priority: A; Tolerance: 10%; PCB Footprint: C0402; Value: 100nF; Part Type: C0402; Manufacturer PN: C1005X5R1C104K050BA; Created by: JJJ
C123 = CAP NP_0: cap,12.00pF,+/-5%,50V,C0G,C0402; Part Reference: C123; Manufacturer: TDK; RK PN: C1005C0G1H120J050BA; Priority: A; Tolerance: 5%; PCB Footprint: C0402; Value: 12pF; Part Type: C0402; Manufacturer PN: C1005C0G1H120J050BA; Created by: JJJ
C124 = CAP NP_0: Did Not Place.; Part Reference: C124; Manufacturer PN: DNPC0402; Priority: A; PCB Footprint: C0402; Value: DNP; Created by: JJJ; Part Type: DNP; RK PN: DNPC0402
C125 = CAP NP_0: cap,100.00nF,+/-10%,10V,X5R,C0402; Part Reference: C125; Manufacturer: TDK; Number: 37; RK PN: C1005X5R1A104K050BA; Priority: A; Tolerance: 10%; C_Voltage: 6.3V; PCB Footprint: C0402; Value: 100nF; Part Type: C0402; Manufacturer PN: C1005X5R1A104K050BA; Created by: JJJ
D28 = DIODE: Schottky Barrier，B5819W SOD-123; Part Reference: D28; Manufacturer: 长电; RK PN: B5819W; Priority: A; PCB Footprint: SOD323; Value: B5819WS; Part Type: Schottky rectifier; Manufacturer PN: B5819W; Created by: JJJ
D42 = DIODE: Schottky Barrier，B5819WS SOD-323; Part Reference: D42; Manufacturer: 长电; Priority: A; PCB Footprint: SOD_323; Value: B5819WS; Created by: JJJ; Manufacturer PN: B5819WS; Part Type: Schottky rectifier; RK PN: B5819WS
D43 = DIODE Double: Dual Schottky barrier，BAT54C SOT-23 Schottky Barrier; Part Reference: D43; Manufacturer: 长电; Priority: A; PCB Footprint: SOT_23; Value: BAT54C; Created by: JJJ; Manufacturer PN: BAT54C; Part Type: Schottky rectifier; RK PN: BAT54C
D44 = DIODE: Schottky Barrier，B5819WS SOD-323; Part Reference: D44; Manufacturer: 长电; Priority: A; PCB Footprint: SOD323; Value: NC; RK PN: B5819WS; Part Type: Schottky rectifier; Manufacturer PN: B5819WS; Created by: JJJ
P1 = TESTPOINT1: Part Reference: P1; PCB Footprint: TP_0R70; Value: TEST
P2 = TESTPOINT1: Part Reference: P2; PCB Footprint: TP_0R70; Value: TEST
P3 = TESTPOINT1: Part Reference: P3; PCB Footprint: TP_0R70; Value: TEST
Q12 = MOSFET N: MOSFET-N,WNM3003 ,30V,+/-20V,4.0A,33m Ohm@Vgs=10V,43m Ohm@Vgs=4.5V,SOT23; Part Reference: Q12; Value: AO3416; PCB Footprint: SOT23
R29 = RESISTOR_0: 通用厚膜电阻,100K,+/-5%,R0402,1/16W.; Part Reference: R29; Manufacturer PN: RC0402JR-07100KL; Manufacturer: YAGEO; Wattage: 1/16W; Tolerance: 5%; Priority: A; Value: FR120R_2A; Created by: YTL; Part Type: R0805; RK PN: RC0402JR-07100KL; PCB Footprint: R0402
R71 = RESISTOR_0: 通用厚膜电阻,100K,+/-5%,R0402,1/16W.; Part Reference: R71; Manufacturer: YAGEO; RK PN: RC0402JR-07100KL; Priority: A; Tolerance: 5%; Wattage: 1/16W; Value: 1K; Part Type: 通用厚膜电阻; Manufacturer PN: RC0402JR-07100KL; Created by: YTL; PCB Footprint: R0201
R72 = RESISTOR_0: 通用厚膜电阻,10K,+/-5%,R0402,1/16W.; Part Reference: R72; Manufacturer: YAGEO; RK PN: RC0402JR-0710KL; Priority: A; Tolerance: 5%; Wattage: 1/16W; Value: NC; Part Type: 通用厚膜电阻; Manufacturer PN: RC0402JR-0710KL; Created by: YTL; PCB Footprint: R0402
R138 = RESISTOR_0: 通用厚膜电阻,10K,+/-5%,R0402,1/16W.; Part Reference: R138; Manufacturer: YAGEO; RK PN: RC0402JR-0710KL; Priority: A; Tolerance: 5%; Wattage: 1/16W; option: DNP; Value: NC/10K; Part Type: 通用厚膜电阻; Manufacturer PN: RC0402JR-0710KL; Created by: YTL; PCB Footprint: R0402
R139 = RESISTOR_0: 通用厚膜电阻,10K,+/-5%,R0402,1/16W.; Part Reference: R139; Manufacturer PN: RC0402JR-0710KL; Manufacturer: YAGEO; option: DNP; Wattage: 1/16W; Tolerance: 5%; Priority: A; Value: NC; Created by: YTL; Part Type: 通用厚膜电阻; RK PN: RC0402JR-0710KL; PCB Footprint: R0402
R140 = RESISTOR_0: 通用厚膜电阻,47K,+/-5%,R0402,1/16W.; Part Reference: R140; Manufacturer PN: RC0402JR-0747KL; Manufacturer: YAGEO; Wattage: 1/16W; Tolerance: 5%; Priority: A; Value: 22R; Created by: YTL; Part Type: 通用厚膜电阻; RK PN: RC0402JR-0747KL; PCB Footprint: R0402
R141 = RESISTOR_0: 通用厚膜电阻,47K,+/-5%,R0402,1/16W.; Part Reference: R141; Manufacturer PN: RC0402JR-0747KL; Manufacturer: YAGEO; Wattage: 1/16W; Tolerance: 5%; Priority: A; Value: 22R; Created by: YTL; Part Type: 通用厚膜电阻; RK PN: RC0402JR-0747KL; PCB Footprint: R0402
R142 = RESISTOR_0: 通用厚膜电阻,10K,+/-5%,R0402,1/16W.; Part Reference: R142; Manufacturer: YAGEO; RK PN: RC0402JR-0710KL; Priority: A; Tolerance: 5%; Wattage: 1/16W; option: DNP; Value: 0R; Part Type: 通用厚膜电阻; Manufacturer PN: RC0402JR-0710KL; Created by: YTL; PCB Footprint: R0402
R143 = RESISTOR_0: 通用厚膜电阻,10K,+/-5%,R0402,1/16W.; Part Reference: R143; Manufacturer PN: RC0402JR-0710KL; Manufacturer: YAGEO; option: DNP; Wattage: 1/16W; Tolerance: 5%; Priority: A; Value: NC; Created by: YTL; Part Type: 通用厚膜电阻; RK PN: RC0402JR-0710KL; PCB Footprint: R0402
TP7 = TP: Test Point 0.7mm; Part Reference: TP7; PCB Footprint: TP_0R70; Priority: A; RK PN: TESTPOINT_0R7; Value: TP_0.7; Created by: JJJ; Part Type: TP
TP8 = TP: Test Point 0.7mm; Part Reference: TP8; PCB Footprint: TP_0R70; Priority: A; RK PN: TESTPOINT_0R7; Value: TP_0.7; Created by: JJJ; Part Type: TP
U3 = CON3_6: Part Reference: U3; Value: SMD_1D25X2PIN_90; PCB Footprint: SMD_1D25X2PIN_90
U23 = CON_BATTERY-20MM_0: Part Reference: U23; PCB Footprint: BAT_CR1220; Value: CR1220-3V
U24 = RTC_HYM8563: I2C Real Time Clock/Calendar; Part Reference: U24; Manufacturer: Haoyu（昊昱微电子）; Priority: A; PCB Footprint: MSOP8; Value: HYM8563TS; RK PN: HYM8563TS; Part Type: RTC; Manufacturer PN: HYM8563TS; Created by: JJJ
Y2 = CRYSTAL_2P_0: 无源晶振，32.768KHz，MC-146,±20ppm，12.5pF，Hosonic; Part Reference: Y2; Manufacturer: Hosonic(鸿星电子); RK PN: ETDE32.768W125BMPF; Priority: A; PCB Footprint: CRY-3215; Value: 32.768KHz; Part Type: CRYSTAL; Manufacturer PN: ETDE32.768W125BMPF; Created by: JJJ
*#13 = radxa_1010: Page Create Date: March  8, 1995; Page Size: =PageSize; Page Modify Date: =ModifiedDate